# EAGLE design psg-single-ad9833 (EAGLE 6.6.0)
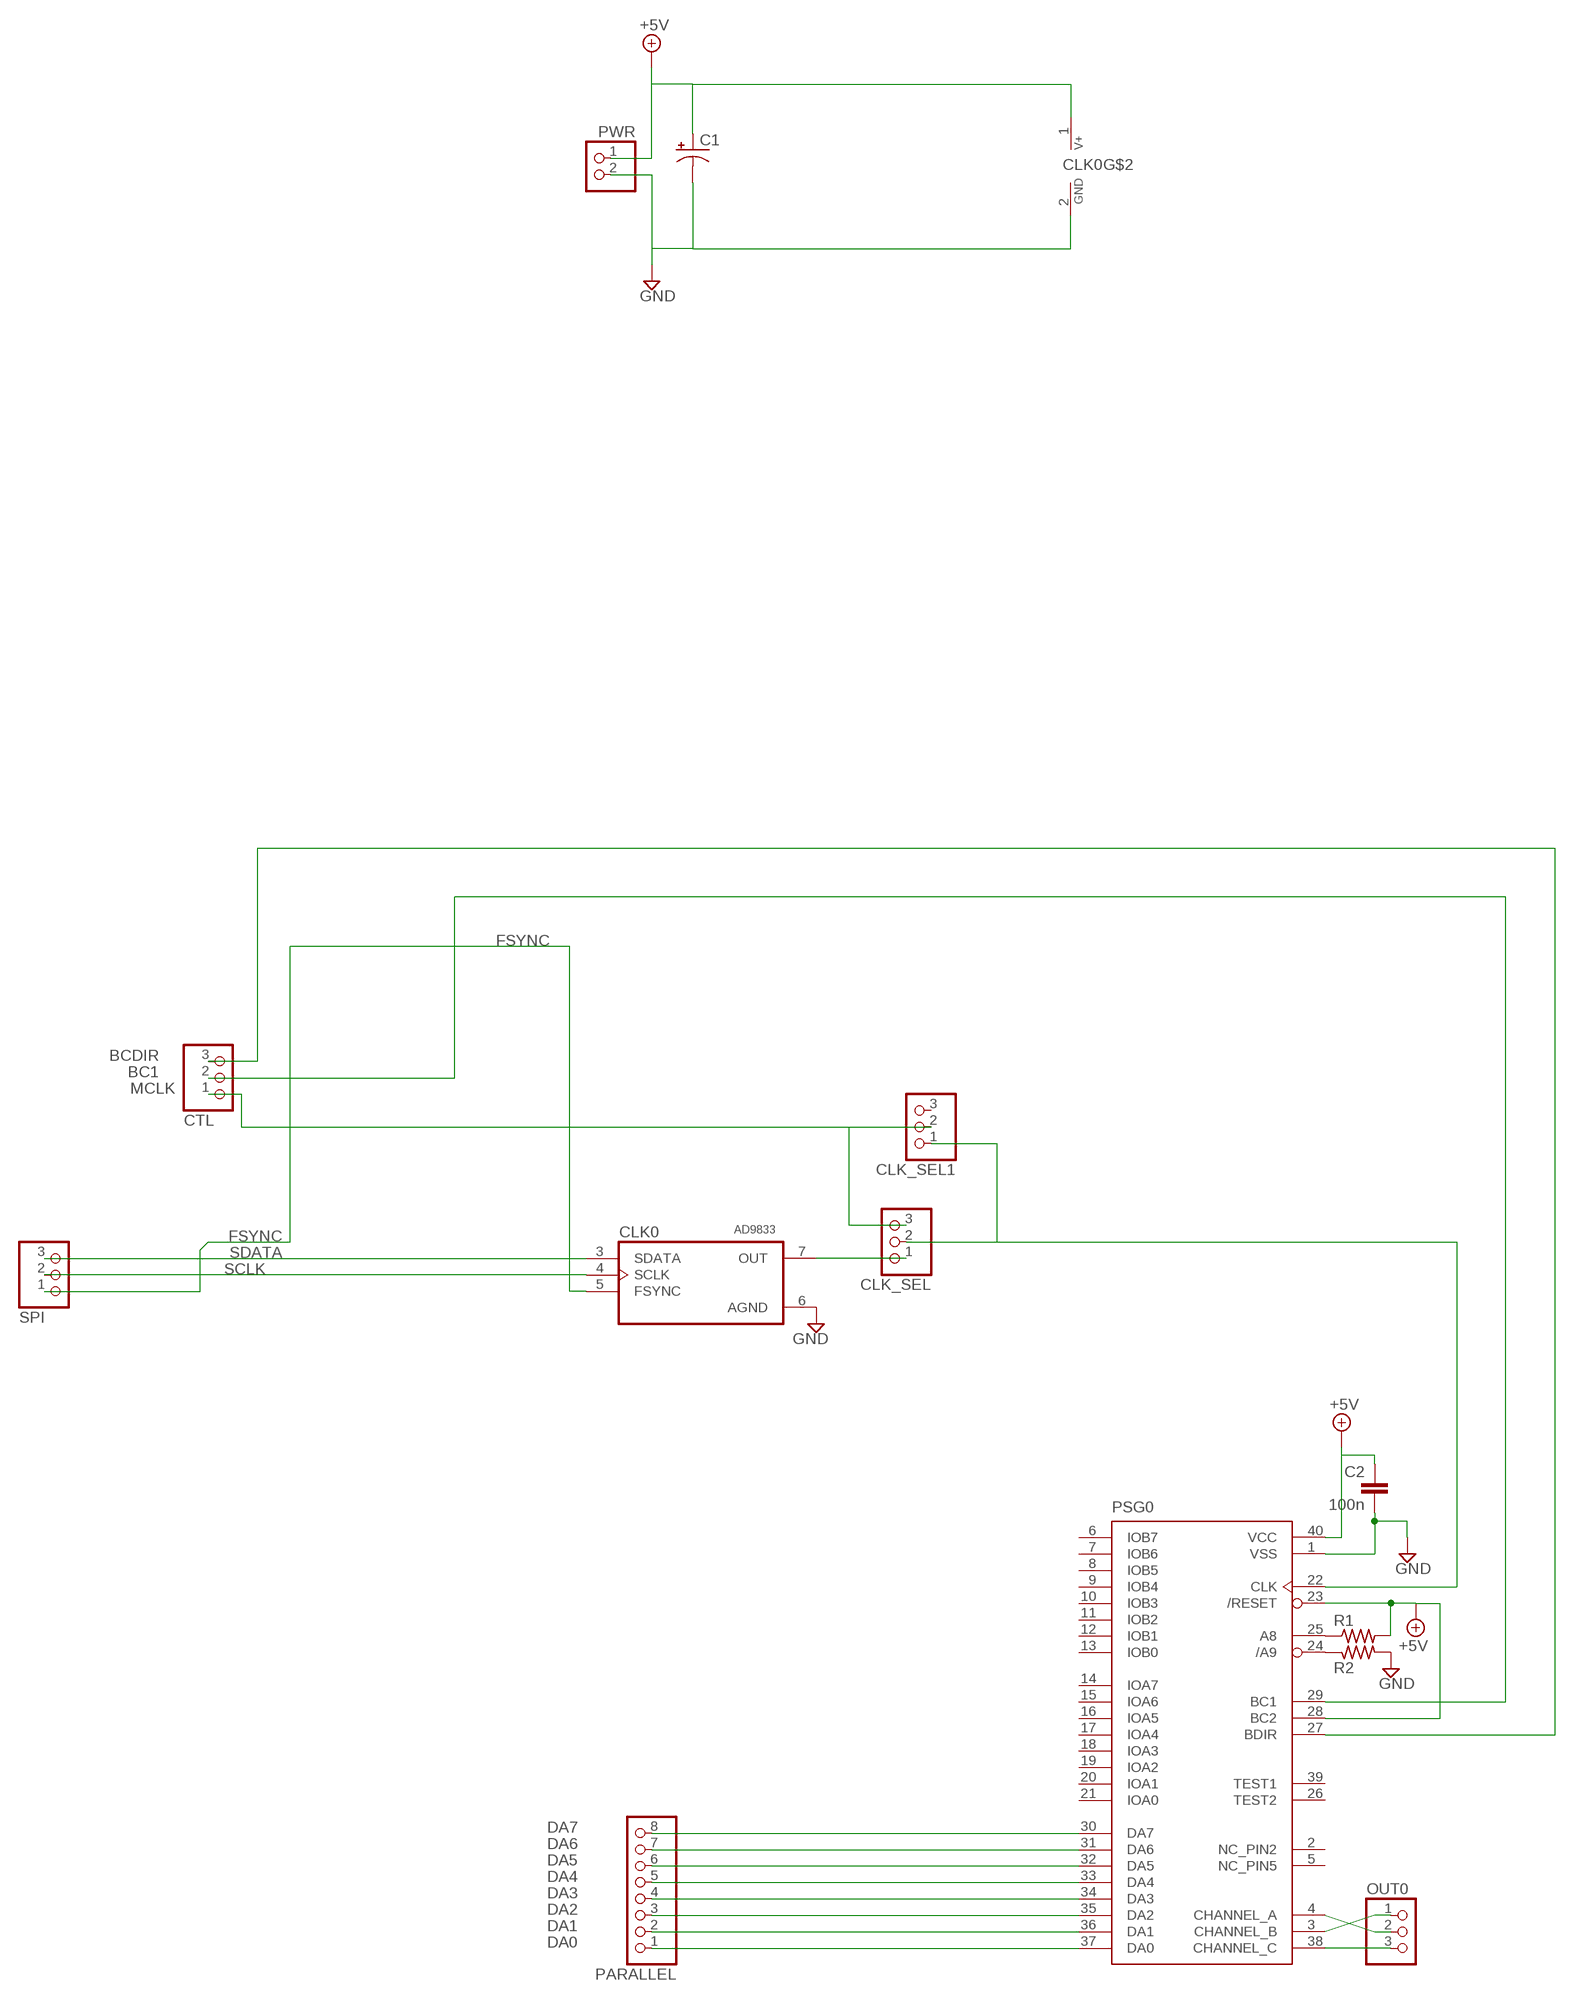
[diagram p0: schematic, sheet 1]

## Parts
C1  0501  [050_020_1]
C2  100n  050X030_0251  [050X030_025]
CLK0  AD9833_MODULE  [AD9833_MODULE]
CLK_SEL  PINHD-1X3/90  [1X03/90]
CLK_SEL1  PINHD-1X3/90  [1X03/90]
CTL  PINHD-1X3/90  [1X03/90]
OUT0  PINHD-1X3/90  [1X03/90]
PARALLEL  PINHD-1X8/90  [1X08/90]
PSG0  AY-3-8910  [DIL40]
PWR  PINHD-1X2/90  [1X02/90]
R1  6MM.3  [R0207/3]
R2  6MM.3  [R0207/3]
SPI  PINHD-1X3/90  [1X03/90]

## Nets
+5V: C1.+ C2.1 CLK0.1(+V) PSG0.23(/RESET) PSG0.28(BC2) PSG0.40(VCC) PWR.1 R1.2
BC1: CTL.2 PSG0.29(BC1)
BCDIR: CTL.3 PSG0.27(BDIR)
CLK_IN_0: CLK_SEL1.1 CLK_SEL.2 PSG0.22(CLK)
DA0: PARALLEL.1 PSG0.37(DA0)
DA1: PARALLEL.2 PSG0.36(DA1)
DA2: PARALLEL.3 PSG0.35(DA2)
DA3: PARALLEL.4 PSG0.34(DA3)
DA4: PARALLEL.5 PSG0.33(DA4)
DA5: PARALLEL.6 PSG0.32(DA5)
DA6: PARALLEL.7 PSG0.31(DA6)
DA7: PARALLEL.8 PSG0.30(DA7)
FSYNC: CLK0.5(FSYNC) SPI.1
GND: C1.- C2.2 CLK0.2(GND) CLK0.6(AGND) PSG0.1(VSS) PWR.2 R2.2
MCLK: CLK_SEL1.2 CLK_SEL.3 CTL.1
N$2: CLK0.7(OUT) CLK_SEL.1
N$14: PSG0.24(/A9) R2.1
N$15: PSG0.25(A8) R1.1
OUT_A: OUT0.2 PSG0.4(CHANNEL_A)
OUT_B: OUT0.1 PSG0.3(CHANNEL_B)
OUT_C: OUT0.3 PSG0.38(CHANNEL_C)
SCLK: CLK0.4(SCLK) SPI.2
SDATA: CLK0.3(SDATA) SPI.3
Unconnected: CLK_SEL1.3 PSG0.2(NC_PIN2) PSG0.5(NC_PIN5) PSG0.6(IOB7) PSG0.7(IOB6) PSG0.8(IOB5) PSG0.9(IOB4) PSG0.10(IOB3) PSG0.11(IOB2) PSG0.12(IOB1) PSG0.13(IOB0) PSG0.14(IOA7) PSG0.15(IOA6) PSG0.16(IOA5) PSG0.17(IOA4) PSG0.18(IOA3) PSG0.19(IOA2) PSG0.20(IOA1) PSG0.21(IOA0) PSG0.26(TEST2) PSG0.39(TEST1)

## Library data of the parts
C1 = gm-caps-electro-pol:050: 0.22 - 100uF Xicon values at Mouser.com: 10V: 10 - 100uF; 16V: 2.2 - 47uF; 25V: 0.47 - 47uF; 50V: 0.22 - 22uF
C2 = gm-caps-ceramic:050X030_025: 47 - 120pF Xicon Ceramic Disc 2.5mm lead spacing
CLK0 = jaapie:AD9833_MODULE
CLK_SEL CLK_SEL1 CTL OUT0 SPI = pinhead:PINHD-1X3: PIN HEADER
PARALLEL = pinhead:PINHD-1X8: PIN HEADER
PSG0 = 8Bit_Parts:AY-3-8910
PWR = pinhead:PINHD-1X2: PIN HEADER
R1 R2 = gm-resistors:6MM: 6mm Resistors Leads spaced 1-6 holes apart for 0.1" perfboard. Suitable for 1/4 watt resistors.

## Board
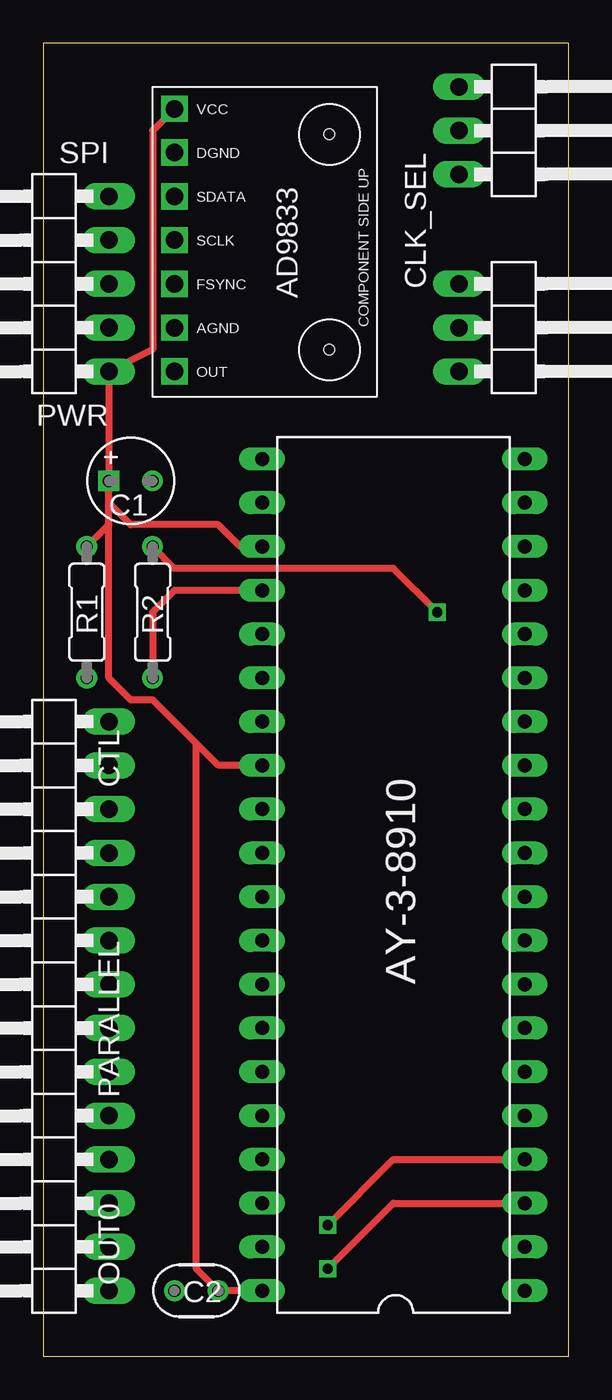
[diagram p1: board, top side]
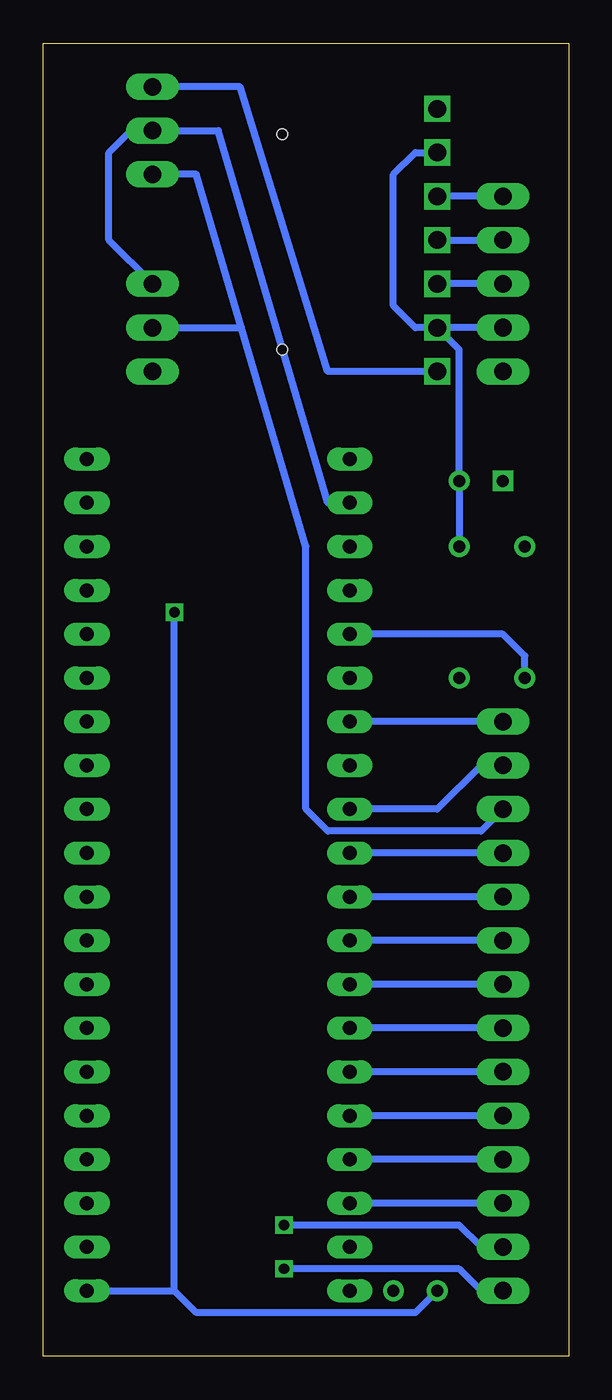
[diagram p2: board, bottom side, seen from below]

Size 30.48 x 76.2 mm. Coordinates in mm from the lower left corner, seen from the top.
Outline: 0,0 30.48,0 30.48,76.2 0,76.2 0,0
Copper layers (1*16): Top 0.035mm / dielectric 1.5mm / Bottom 0.035mm
Design rules "default": minimum track width 10mil, minimum drill 24mil, track to track 8mil, track to pad 8mil, pad to pad 8mil, via to via 8mil, smd to smd 8mil, copper to edge 40mil, drill to drill 8mil, minimum pad ring 10mil, minimum via ring 8mil, stop-mask expansion 4mil, vias tented up to drill 0mil, thermal gap 10mil

### Footprints (pad centres in the part's own frame; a part is rotated, then mirrored left to right if it is on the bottom)
050_020_1 = drill 0.7 square: + -1.27,0 | drill 0.7: - 1.27,0
050X030_025 = drill 0.7: 1 -1.27,0; 2 1.27,0
AD9833_MODULE = drill 1.016 square: 1 1.27,1.27; 2 3.81,1.27; 3 6.35,1.27; 4 8.89,1.27; 5 11.43,1.27; 6 13.97,1.27; 7 16.51,1.27 | hole 0.6: 15.25,10.25; 2.75,10.25
1X03/90 = drill 1.016 long: 1 -2.54,-3.81; 2 0,-3.81; 3 2.54,-3.81
1X08/90 = drill 1.016 long: 1 -8.89,-3.81; 2 -6.35,-3.81; 3 -3.81,-3.81; 4 -1.27,-3.81; 5 1.27,-3.81; 6 3.81,-3.81; 7 6.35,-3.81; 8 8.89,-3.81
DIL40 = drill 0.813 long: 1 -24.13,-7.62; 2 -21.59,-7.62; 3 -19.05,-7.62; 4 -16.51,-7.62; 5 -13.97,-7.62; 6 -11.43,-7.62; 7 -8.89,-7.62; 8 -6.35,-7.62; 9 -3.81,-7.62; 10 -1.27,-7.62; 11 1.27,-7.62; 12 3.81,-7.62; 13 6.35,-7.62; 14 8.89,-7.62; 15 11.43,-7.62; 16 13.97,-7.62; 17 16.51,-7.62; 18 19.05,-7.62; 19 21.59,-7.62; 20 24.13,-7.62; 21 24.13,7.62; 22 21.59,7.62; 23 19.05,7.62; 24 16.51,7.62; 25 13.97,7.62; 26 11.43,7.62; 27 8.89,7.62; 28 6.35,7.62; 29 3.81,7.62; 30 1.27,7.62; 31 -1.27,7.62; 32 -3.81,7.62; 33 -6.35,7.62; 34 -8.89,7.62; 35 -11.43,7.62; 36 -13.97,7.62; 37 -16.51,7.62; 38 -19.05,7.62; 39 -21.59,7.62; 40 -24.13,7.62
1X02/90 = drill 1.016 long: 1 -1.27,-3.81; 2 1.27,-3.81
R0207/3 = drill 0.7: 1 -3.81,0; 2 3.81,0

### Placement (x,y rotation side)
C1  5.08,50.8 0 top
C2  8.89,3.81 180 top
CLK0  6.35,73.66 270 top
CLK_SEL  27.94,71.12 270 top
CLK_SEL1  27.94,59.69 270 top
CTL  0,34.29 90 top
OUT0  0,6.35 90 top
PARALLEL  0,20.32 90 top
PSG0  20.32,27.94 90 top
PWR  0,58.42 90 top
R1  2.54,43.18 90 top
R2  6.35,43.18 90 top
SPI  0,64.77 90 top

### Tracks (layer width: path | path; a pad name or v marks a point on that pad's centre or on a via)
+5V
  Top 0.406: CLK0.1 6.35,71.12 6.35,58.42 PWR.1 C1.+ 3.81,49.53 | PSG0.40 C2.1 8.89,5.08 8.89,35.56 | 8.89,35.56 6.35,38.1 5.08,38.1 3.81,39.37 3.81,48.26 | 3.81,48.26 3.81,49.53 | R1.2 3.81,48.26 | PSG0.23 11.43,46.99 10.16,48.26 5.08,48.26 3.81,49.53 | PSG0.28 10.16,34.29 8.89,35.56
BC1
  Bottom 0.406: CTL.2 5.08,34.29 7.62,31.75 PSG0.29
BCDIR
  Bottom 0.406: CTL.3 PSG0.27
CLK_IN_0
  Bottom 0.406: PSG0.22 13.97,49.53 20.32,71.12 CLK_SEL.2 25.4,71.12 26.67,69.85 26.67,64.77 CLK_SEL1.1
DA0
  Bottom 0.406: PARALLEL.1 PSG0.37
DA1
  Bottom 0.406: PARALLEL.2 PSG0.36
DA2
  Bottom 0.406: PARALLEL.3 PSG0.35
DA3
  Bottom 0.406: PARALLEL.4 PSG0.34
DA4
  Bottom 0.406: PARALLEL.5 PSG0.33
DA5
  Bottom 0.406: PARALLEL.6 PSG0.32
DA6
  Bottom 0.406: PARALLEL.7 PSG0.31
DA7
  Bottom 0.406: PARALLEL.8 PSG0.30
FSYNC
  Bottom 0.406: SPI.1 CLK0.5
GND  (via drill 0.6)
  Top 0.406: v22.86,43.18 20.32,45.72 7.62,45.72 R2.2
  Bottom 0.406: CLK0.6 6.35,58.42 C1.- R2.2 | CLK0.6 8.89,59.69 10.16,60.96 10.16,68.58 8.89,69.85 CLK0.2 | PSG0.1 22.86,3.81 | 22.86,3.81 v22.86,43.18 | PWR.2 CLK0.6 | C2.2 8.89,2.54 21.59,2.54 22.86,3.81
MCLK
  Bottom 0.406: CTL.1 5.08,30.48 13.97,30.48 15.24,31.75 15.24,46.99 18.98,59.71 | 18.98,59.71 21.59,68.58 CLK_SEL.3 | CLK_SEL1.2 18.98,59.69 18.98,59.71
N$2
  Bottom 0.406: CLK0.7 13.97,57.15 19.05,73.66 CLK_SEL.1
N$14
  Top 0.406: PSG0.24 7.62,44.45 6.35,43.18 R2.1
N$15
  Bottom 0.406: R1.1 2.54,40.64 3.81,41.91 PSG0.25
OUT_A  (via drill 0.6)
  Top 0.406: v16.51,7.62 20.32,11.43 PSG0.4
  Bottom 0.406: OUT0.2 5.08,6.35 6.35,7.62 v16.51,7.62
OUT_B  (via drill 0.6)
  Top 0.406: v16.51,5.08 20.32,8.89 PSG0.3
  Bottom 0.406: OUT0.1 5.08,3.81 6.35,5.08 v16.51,5.08
OUT_C
  Bottom 0.406: OUT0.3 PSG0.38
SCLK
  Bottom 0.406: CLK0.4 SPI.2
SDATA
  Bottom 0.406: SPI.3 CLK0.3

### Text on the board
tNames: AY-3-8910